# Altium schematic sheet Sheet1.SchDoc
size A4
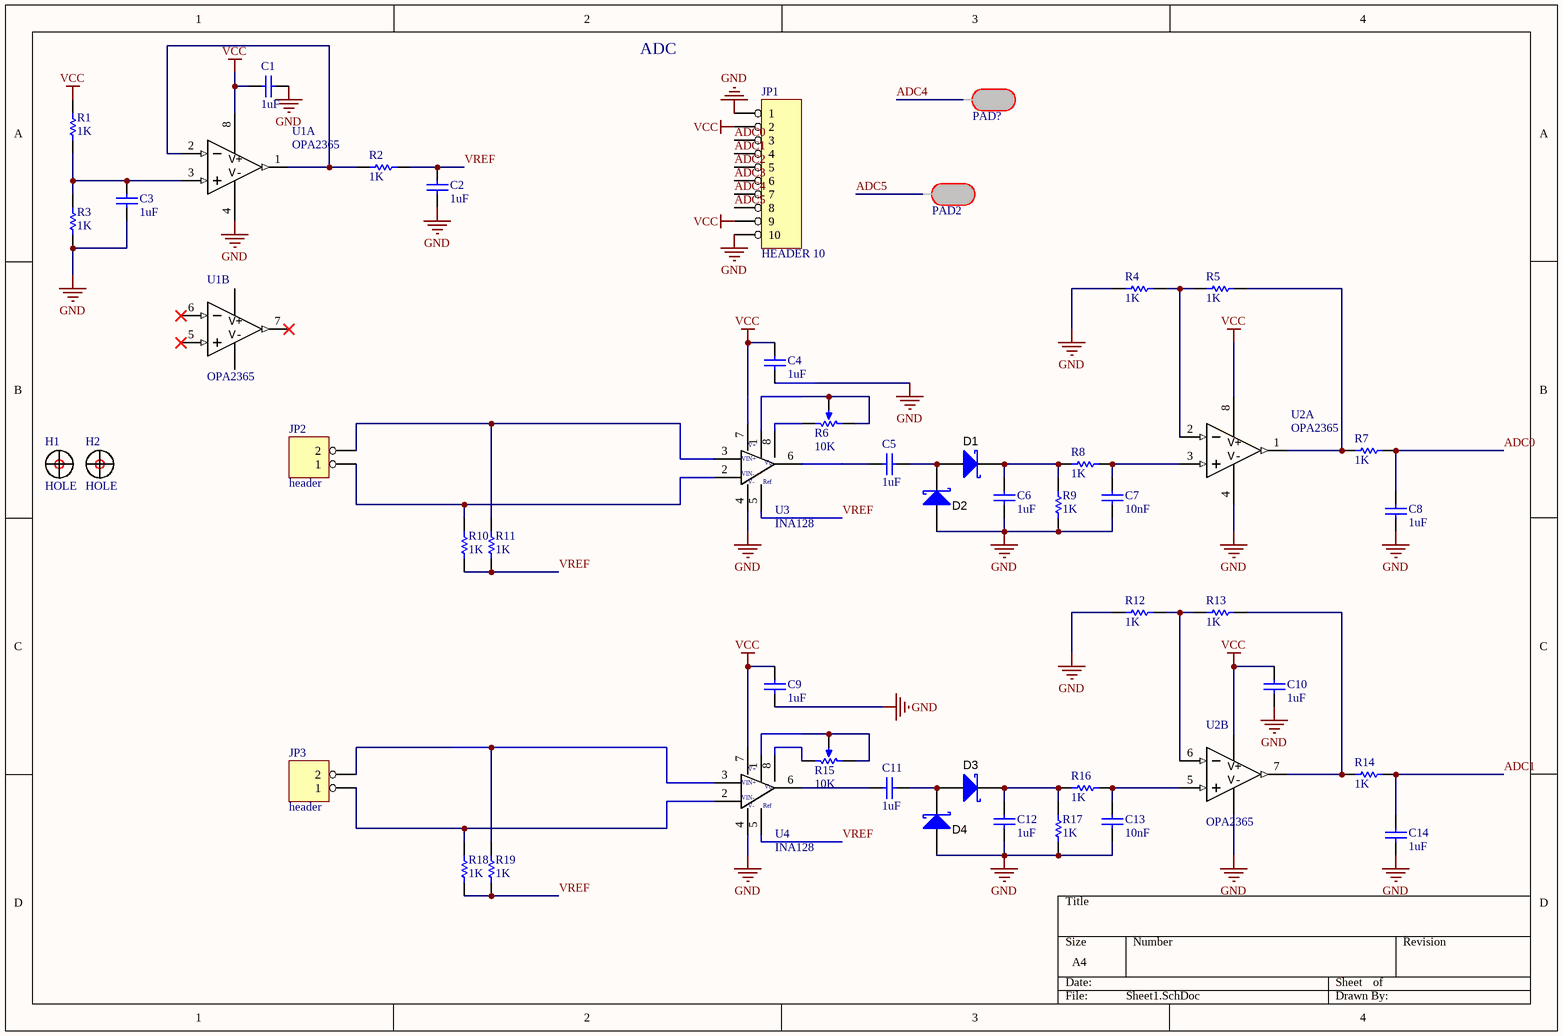
[diagram p0: Sheet1.SchDoc]

## Parts
C1  1uF  [0603_C]
C2  1uF  [0603_C]
C3  1uF  [0603_C]
C4  1uF  [0603_C]
C5  1uF  [0603_C]
C6  1uF  [0603_C]
C7  10nF  [0603_C]
C8  1uF  [0603_C]
C9  1uF  [0603_C]
C10  1uF  [0603_C]
C11  1uF  [0603_C]
C12  1uF  [0603_C]
C13  10nF  [0603_C]
C14  1uF  [0603_C]
D1  Diode, Schottky  [SOD323]  (value not drawn)
D2  Diode, Schottky  [SOD323]  (value not drawn)
D3  Diode, Schottky  [SOD323]  (value not drawn)
D4  Diode, Schottky  [SOD323]  (value not drawn)
H1  HOLE  [定位孔 Φ3 1]
H2  HOLE  [定位孔 Φ3 1]
JP1  HEADER 10  [HEADER_10P_1.25_UP]
JP2  header  [header2]
JP3  header  [header2]
PAD2  PAD  [SMALL PAD]  (value not drawn)
PAD?  PAD  [SMALL PAD]  (value not drawn)
R1  1K  [R0603]
R2  1K  [R0603]
R3  1K  [R0603]
R4  1K  [R0603]
R5  1K  [R0603]
R6  10K  [3224W]
R7  1K  [R0603]
R8  1K  [R0603]
R9  1K  [R0603]
R10  1K  [R0603]
R11  1K  [R0603]
R12  1K  [R0603]
R13  1K  [R0603]
R14  1K  [R0603]
R15  10K  [3224W]
R16  1K  [R0603]
R17  1K  [R0603]
R18  1K  [R0603]
R19  1K  [R0603]
U1  OPA2365  [SOIC-8]  (parts A,B of 2)
U2  OPA2365  [SOP8]  (parts A,B of 2)
U3  INA128  [SOIC-8]
U4  INA128  [SOIC-8]

## Nets
GND: C1.2 C2.1 C3.1 C4.1 C6.1 C7.1 C8.1 C9.1 C10.1 C12.1 C13.1 C14.1 D2.2(A) D4.2(A) JP1.1 JP1.10 R3.1 R4.2 R9.1 R12.2 R17.1 U1.4(V-) U2.4(V-) U3.4(V-) U4.4(V-)
VCC: C1.1 C4.2 C9.2 C10.2 JP1.2 JP1.9 R1.2 U1.8(V+) U2.8(V+) U3.7(V+) U4.7(V+)
ADC0: C8.2 JP1.3 R7.1
ADC1: C14.2 JP1.4 R14.1
ADC2: JP1.5
ADC3: JP1.6
ADC4: JP1.7 PAD?.1
ADC5: JP1.8 PAD2.1
VREF: C2.2 R2.2 R10.1 R11.1 R18.1 R19.1 U3.5(Ref) U4.5(Ref)
NetC3_2: C3.2 R1.1 R3.2 U1.3(1IN+)
NetC5_1: C5.1 D1.2(A) D2.1(K)
NetC5_2: C5.2 U3.6(Vo)
NetC6_2: C6.2 D1.1(K) R8.2 R9.2
NetC7_2: C7.2 R8.1 U2.3(1IN+)
NetC11_1: C11.1 D3.2(A) D4.1(K)
NetC11_2: C11.2 U4.6(Vo)
NetC12_2: C12.2 D3.1(K) R16.2 R17.2
NetC13_2: C13.2 R16.1 U2.5(2IN+)
NetJP2_1: JP2.1 R10.2 U3.2(VIN-)
NetJP2_2: JP2.2 R11.2 U3.3(VIN+)
NetJP3_1: JP3.1 R18.2 U4.2(VIN-)
NetJP3_2: JP3.2 R19.2 U4.3(VIN+)
NetR2_1: R2.1 U1.1(1OUT) U1.2(1IN-)
NetR4_1: R4.1 R5.2 U2.2(1IN-)
NetR5_1: R5.1 R7.2 U2.1(1OUT)
NetR6_1: R6.1(BOT) R6.2(TAP) U3.1
NetR6_3: R6.3(TOP) U3.8
NetR12_1: R12.1 R13.2 U2.6(2IN-)
NetR13_1: R13.1 R14.2 U2.7(2OUT)
NetR15_1: R15.1(BOT) R15.2(TAP) U4.1
NetR15_3: R15.3(TOP) U4.8

Not connected (* = marked no-connect by the designer): H1 1; H2 1; U1 5(2IN+)* 6(2IN-)* 7(2OUT)*

## Notes on the sheet
- ADC

## Library data of the parts
C1-C14 = CAP: Capacitor; Value: 104; Published: 8-Jun-2000; LatestRevisionDate: 17-Jul-2002; LatestRevisionNote: Re-released for DXP Platform.; PackageReference: RAD-0.3; Publisher: Altium Limited
D1-D4 = D_Schottky: Diode, Schottky, 40 V, 0.2 A, DO-213AC; Manufacturer: Vishay-Semiconductor; PartNumber: LL103A-GS08; U/M: EA; Vf_V: 0.6; Value: 40V; Value1: 0.2A; Value2: 0.6V; Io_A: 0.2; Vr_V: 40; TJmax_C: 125; AEC Category: Q101; SymbolVersion: 2008-12-08; MountType: SMT; RoHS: Y; PackageReference: DO-213AC; ComponentLink1Description: Datasheet link; ComponentLink1URL: http://www.diodes.com/datasheets/ds30258.pdf; CompType: Diode; Type: Schottky; Published: 2008-06-26; Publisher: Texas Instruments; LatestRevisionDate: 2016-03-10; Supplier 1: Digi-Key; Supplier Part Number 1: LL103A-GS08CT-ND; Supplier 2: Mouser; Supplier Part Number 2: 625-LL103A; Supplier 3: Farnell; Supplier Part Number 3: 1469389; AEC Qualified: ?
JP2 JP3 = HEADER 2
R1-R5 R7-R14 R16-R19 = RES: Resistor; Published: 8-Jun-2000; Revision: July-2002: Re-released for DXP Platform.; Publisher: Altium Limited; Value: 1K
R6 R15 = 单联电位器
U1 U2 = OPA2365: Imported; Manufacturer: Texas Instruments; Manufacturer_Part_Number: opa2365_d_8; INDUSTRY_STD_PKG_TYPE: SOIC; FAMILY_NAME: LOW OFFSET VOLTAGE; PIN_COUNT: 8; PACKAGE_DESIGNATOR: D; Datasheet URL: http://www.ti.com/lit/gpn/OPA2365; GENERIC_PART_NUMBER: OPA2365; Vendor: Texas Instruments; RefDes: RefDes; Type: DEV; Value: Value
U3 U4 = INA118